# EAGLE design peltier (EAGLE 7.5.0)
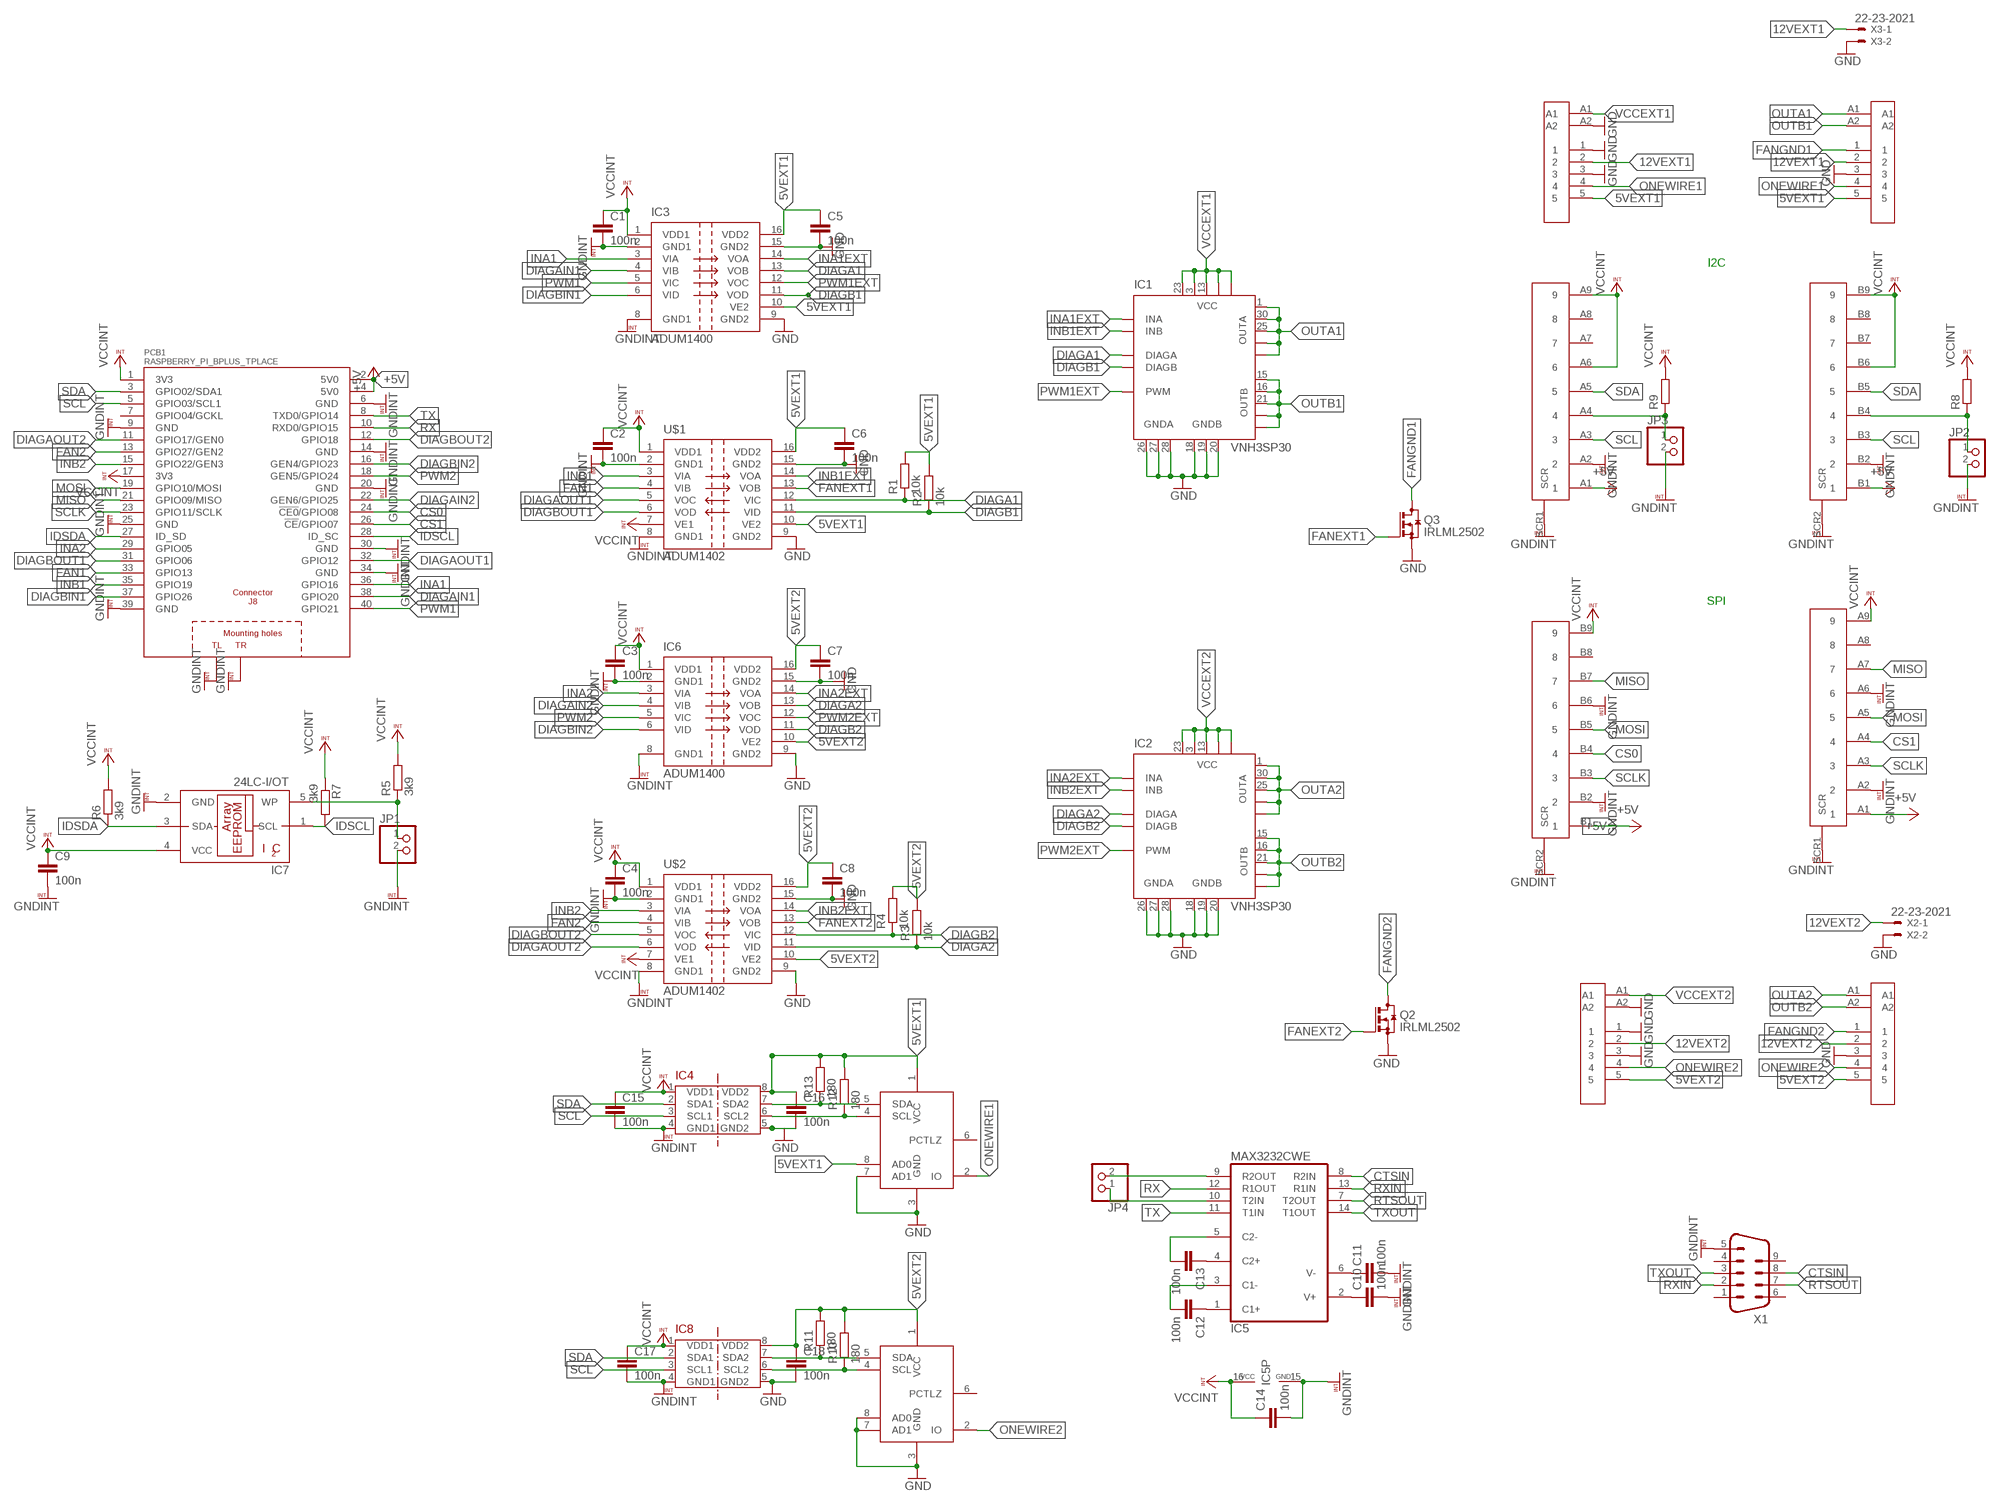
[diagram p0: schematic, sheet 1]

## Parts
C1  100n  C-EUC0805  [C0805]
C2  100n  C-EUC0805  [C0805]
C3  100n  C-EUC0805  [C0805]
C4  100n  C-EUC0805  [C0805]
C5  100n  C-EUC0805  [C0805]
C6  100n  C-EUC0805  [C0805]
C7  100n  C-EUC0805  [C0805]
C8  100n  C-EUC0805  [C0805]
C9  100n  C-EUC0805  [C0805]
C10  100n  C-EUC0805  [C0805]
C11  100n  C-EUC0805  [C0805]
C12  100n  C-EUC0805  [C0805]
C13  100n  C-EUC0805  [C0805]
C14  100n  C-EUC0805  [C0805]
C15  100n  C-EUC0805  [C0805]
C16  100n  C-EUC0805  [C0805]
C17  100n  C-EUC0805  [C0805]
C18  100n  C-EUC0805  [C0805]
IC1  VNH3SP30  [MULTIPOWERSO-30]
IC2  VNH3SP30  [MULTIPOWERSO-30]
IC3  ADUM1400  [SO16W]
IC4  ADUM1250  [SO08]
IC5  MAX3232CWE  [SO16L]
IC6  ADUM1400  [SO16W]
IC7  24LC-I/OT  [SOT23-5]
IC8  ADUM1250  [SO08]
JP1  PINHD-1X2  [1X02]
JP2  PINHD-1X2  [1X02]
JP3  PINHD-1X2  [1X02]
JP4  PINHD-1X2  [1X02]
PCB1  RASPBERRY_PI_BPLUS_TPLACE  [RASPBERRY_PI_BPLUS_TPLACE]
Q2  IRLML2502  BSS123  [SOT23]
Q3  IRLML2502  BSS123  [SOT23]
R1  10k  R-EU_R0805  [R0805]
R2  10k  R-EU_R0805  [R0805]
R3  10k  R-EU_R0805  [R0805]
R4  10k  R-EU_R0805  [R0805]
R5  3k9  R-EU_R0805  [R0805]
R6  3k9  R-EU_R0805  [R0805]
R7  3k9  R-EU_R0805  [R0805]
R8  R-EU_R0805  [R0805]
R9  R-EU_R0805  [R0805]
R10  180  R-EU_R0805  [R0805]
R11  180  R-EU_R0805  [R0805]
R12  180  R-EU_R0805  [R0805]
R13  180  R-EU_R0805  [R0805]
U$1  ADUM1402  [SO16W]
U$2  ADUM1402  [SO16W]
U$3  7W2-F  [7W2-F]
U$4  7W2-F  [7W2-F]
U$5  7W2-M  [7W2-M]
U$6  7W2-M  [7W2-M]
U$11  164A19919X  [164A19919X]
U$12  164A19919X  [164A19919X]
U$14  DS2483-100  [SO-08]
U$15  DS2483-100  [SO-08]
X1  M09HP  [M09HP]
X2  22-23-2021  [22-23-2021]
X3  22-23-2021  [22-23-2021]

## Nets
5VEXT1: C5.1 C6.1 C16.1 IC3.10(VE2) IC3.16(VDD2) IC4.8(VDD2) R1.2 R2.2 R12.2 R13.2 U$1.10(VE2) U$1.16(VDD2) U$3.5 U$5.5 U$14.1(VCC) U$14.8(AD0)
5VEXT2: C7.1 C8.1 C18.1 IC6.10(VE2) IC6.16(VDD2) IC8.8(VDD2) R3.2 R4.2 R10.2 R11.2 U$2.10(VE2) U$2.16(VDD2) U$4.5 U$6.5 U$15.1(VCC)
12VEXT1: U$3.2 U$5.2 X3.1
12VEXT2: U$4.2 U$6.2 X2.1
+5V: PCB1.2(5V0) PCB1.4(5V0) U$11.A1 U$11.B1 U$12.A1 U$12.B1
CS0: PCB1.24(!CE0!/GPIO08) U$12.B4
CS1: PCB1.26(!CE!/GPIO07) U$12.A4
CTSIN: IC5.8(R2IN) X1.8
DIAGA1: IC1.6(DIAGA) IC3.13(VOB) R1.1 U$1.12(VIC)
DIAGA2: IC2.6(DIAGA) IC6.13(VOB) R3.1 U$2.11(VID)
DIAGAIN1: IC3.4(VIB) PCB1.38(GPIO20)
DIAGAIN2: IC6.4(VIB) PCB1.22(GEN6/GPIO25)
DIAGAOUT1: PCB1.32(GPIO12) U$1.5(VOC)
DIAGAOUT2: PCB1.11(GPIO17/GEN0) U$2.6(VOD)
DIAGB1: IC1.10(DIAGB) IC3.11(VOD) R2.1 U$1.11(VID)
DIAGB2: IC2.10(DIAGB) IC6.11(VOD) R4.1 U$2.12(VIC)
DIAGBIN1: IC3.6(VID) PCB1.37(GPIO26)
DIAGBIN2: IC6.6(VID) PCB1.16(GEN4/GPIO23)
DIAGBOUT1: PCB1.31(GPIO06) U$1.6(VOD)
DIAGBOUT2: PCB1.12(GPIO18) U$2.5(VOC)
FAN1: PCB1.33(GPIO13) U$1.4(VIB)
FAN2: PCB1.13(GPIO27/GEN2) U$2.4(VIB)
FANEXT1: Q3.1(G) U$1.13(VOB)
FANEXT2: Q2.1(G) U$2.13(VOB)
FANGND1: Q3.3(D) U$3.1
FANGND2: Q2.3(D) U$4.1
GND: C5.2 C6.2 C7.2 C8.2 C16.2 C18.2 IC1.18(GNDB) IC1.19(GNDB) IC1.20(GNDB) IC1.26(GNDA) IC1.27(GNDA) IC1.28(GNDA) IC2.18(GNDB) IC2.19(GNDB) IC2.20(GNDB) IC2.26(GNDA) IC2.27(GNDA) IC2.28(GNDA) IC3.9(GND2) IC3.15(GND2) IC4.5(GND2) IC6.9(GND2) IC6.15(GND2) IC8.5(GND2) Q2.2(S) Q3.2(S) U$1.9(GND2) U$1.15(GND2) U$2.9(GND2) U$2.15(GND2) U$3.3 U$4.3 U$5.1 U$5.3 U$5.A2 U$6.1 U$6.3 U$6.A2 U$14.3(GND) U$14.7(AD1) U$15.3(GND) U$15.7(AD1) U$15.8(AD0) X2.2 X3.2
GNDINT: C1.2 C2.2 C3.2 C4.2 C9.2 C10.2 C11.2 C14.2 C15.2 C17.2 IC3.2(GND1) IC3.8(GND1) IC4.4(GND1) IC5.15(GND) IC6.2(GND1) IC6.8(GND1) IC7.2(GND) IC8.4(GND1) JP1.2 JP2.2 JP3.2 PCB1.6(GND) PCB1.9(GND) PCB1.14(GND) PCB1.20(GND) PCB1.25(GND) PCB1.30(GND) PCB1.34(GND) PCB1.39(GND) PCB1.PE_TL(TL) PCB1.PE_TR(TR) U$1.2(GND1) U$1.8(GND1) U$2.2(GND1) U$2.8(GND1) U$11.A2 U$11.B2 U$11.SCR1(A:SCR) U$11.SCR2(B:SCR) U$12.A2 U$12.A6 U$12.B2 U$12.B6 U$12.SCR1(A:SCR) U$12.SCR2(B:SCR) X1.5
IDSCL: IC7.1(SCL) PCB1.28(ID_SC) R7.2
IDSDA: IC7.3(SDA) PCB1.27(ID_SD) R6.1
INA1: IC3.3(VIA) PCB1.36(GPIO16)
INA1EXT: IC1.5(INA) IC3.14(VOA)
INA2: IC6.3(VIA) PCB1.29(GPIO05)
INA2EXT: IC2.5(INA) IC6.14(VOA)
INB1: PCB1.35(GPIO19) U$1.3(VIA)
INB1EXT: IC1.11(INB) U$1.14(VOA)
INB2: PCB1.15(GPIO22/GEN3) U$2.3(VIA)
INB2EXT: IC2.11(INB) U$2.14(VOA)
MISO: PCB1.21(GPIO09/MISO) U$12.A7 U$12.B7
MOSI: PCB1.19(GPIO10/MOSI) U$12.A5 U$12.B5
N$28: IC7.5(WP) JP1.1 R5.1
N$38: JP3.1 R9.1 U$11.A4
N$39: JP2.1 R8.1 U$11.B4
N$59: C10.1 IC5.2(V+)
N$60: C11.1 IC5.6(V-)
N$61: C12.1 IC5.1(C1+)
N$62: C12.2 IC5.3(C1-)
N$63: C13.1 IC5.4(C2+)
N$64: C13.2 IC5.5(C2-)
N$68: IC5.9(R2OUT) JP4.2
N$69: IC5.10(T2IN) JP4.1
N$71: IC4.7(SDA2) R13.1 U$14.5(SDA)
N$72: IC4.6(SCL2) R12.1 U$14.4(SCL)
N$74: IC8.7(SDA2) R11.1 U$15.5(SDA)
N$75: IC8.6(SCL2) R10.1 U$15.4(SCL)
ONEWIRE1: U$3.4 U$5.4 U$14.2(IO)
ONEWIRE2: U$4.4 U$6.4 U$15.2(IO)
OUTA1: IC1.1(OUTA) IC1.25(OUTA) IC1.30(OUTA) IC1.OUTA IC1.OUTA@1(OUTA) U$3.A1
OUTA2: IC2.1(OUTA) IC2.25(OUTA) IC2.30(OUTA) IC2.OUTA IC2.OUTA@1(OUTA) U$4.A1
OUTB1: IC1.15(OUTB) IC1.16(OUTB) IC1.21(OUTB) IC1.OUTB IC1.OUTB@1(OUTB) U$3.A2
OUTB2: IC2.15(OUTB) IC2.16(OUTB) IC2.21(OUTB) IC2.OUTB IC2.OUTB@1(OUTB) U$4.A2
PWM1: IC3.5(VIC) PCB1.40(GPIO21)
PWM1EXT: IC1.8(PWM) IC3.12(VOC)
PWM2: IC6.5(VIC) PCB1.18(GEN5/GPIO24)
PWM2EXT: IC2.8(PWM) IC6.12(VOC)
RTSOUT: IC5.7(T2OUT) X1.7
RX: IC5.12(R1OUT) PCB1.10(RXD0/GPIO15)
RXIN: IC5.13(R1IN) X1.2
SCL: IC4.3(SCL1) IC8.3(SCL1) PCB1.5(GPIO03/SCL1) U$11.A3 U$11.B3
SCLK: PCB1.23(GPIO11/SCLK) U$12.A3 U$12.B3
SDA: IC4.2(SDA1) IC8.2(SDA1) PCB1.3(GPIO02/SDA1) U$11.A5 U$11.B5
TX: IC5.11(T1IN) PCB1.8(TXD0/GPIO14)
TXOUT: IC5.14(T1OUT) X1.3
VCCEXT1: IC1.3(VCC) IC1.13(VCC) IC1.23(VCC) IC1.VCC IC1.VCC@1(VCC) U$5.A1
VCCEXT2: IC2.3(VCC) IC2.13(VCC) IC2.23(VCC) IC2.VCC IC2.VCC@1(VCC) U$6.A1
VCCINT: C1.1 C2.1 C3.1 C4.1 C9.1 C14.1 C15.1 C17.1 IC3.1(VDD1) IC4.1(VDD1) IC5.16(VCC) IC6.1(VDD1) IC7.4(VCC) IC8.1(VDD1) PCB1.1(3V3) PCB1.17(3V3) R5.2 R6.2 R7.1 R8.2 R9.2 U$1.1(VDD1) U$1.7(VE1) U$2.1(VDD1) U$2.7(VE1) U$11.A6 U$11.A9 U$11.B6 U$11.B9 U$12.A9 U$12.B9
Unconnected: PCB1.7(GPIO04/GCKL) U$11.A7 U$11.A8 U$11.B7 U$11.B8 U$12.A8 U$12.B8 U$14.6(PCTLZ) U$15.6(PCTLZ) X1.1 X1.4 X1.6 X1.9

## Notes on the sheet
- I2C
- SPI

## Library data of the parts
C1-C18 = rcl:C-EU: CAPACITOR, European symbol
IC1 IC2 = custom:VNH3SP30: FULLY INTEGRATED H-BRIDGE MOTOR DRIVER Source: http://pdf1.alldatasheet.com/datasheet-pdf/view/84563/STMICROELECTRONICS/VNH3SP30.html; MPN: VNH3SP30-E; OC_FARNELL: 1739420; OC_NEWARK: 33R1486
IC3 IC6 = adum140x:ADUM1400
IC4 IC8 = Bus-isolators:ADUM1250
IC5 = maxim:MAX3232*: True RS-232 Transceivers 3.0V to 5.5V, Low-Power up to 1Mbps, Using Four 0.1µF External Capacitors Source: http://pdfserv.maxim-ic.com/en/ds/MAX3222-MAX3241.pdf; MF: MAXIM; MPN: MAX3232CWE+; OC_FARNELL: 9725504; OC_NEWARK: 68K4630
IC7 = we-chip:24LC*: Microchip I2C EEPROM 2 Kbit - 24LC02B - 24LC02BT-I/OTDKR-ND 32 Kbit- 24LC32A - 24LC32AT-I/OTDKR-ND; DIGIKEY: 24LC32AT-I/OTDKR-ND
JP1-JP4 = pinhead:PINHD-1X2: PIN HEADER
PCB1 = custom:RASPBERRY_PI_BPLUS: Raspberry Pi B+ Basedon issue: Thursday, July 10, 2014 - Rev 1.2 LBR by Tim Rettmann 07-2014
Q2 Q3 = transistor-small-signal:BSS123: N-CHANNEL MOS FET
R1-R13 = rcl:R-EU_: RESISTOR, European symbol
U$1 U$2 = adum140x:ADUM1402
U$3 U$4 = conec:7W2-F
U$5 U$6 = conec:7W2-M
U$11 U$12 = conec:164A19919X
U$14 U$15 = custom:DS2483-100
X1 = con-subd:M09: SUB-D; OC_FARNELL: unknown; OC_NEWARK: unknown
X2 X3 = con-molex:22-23-2021: .100" (2.54mm) Center Header - 2 Pin; MF: MOLEX; MPN: 22-23-2021; OC_FARNELL: 1462926; OC_NEWARK: 25C3832

## Board
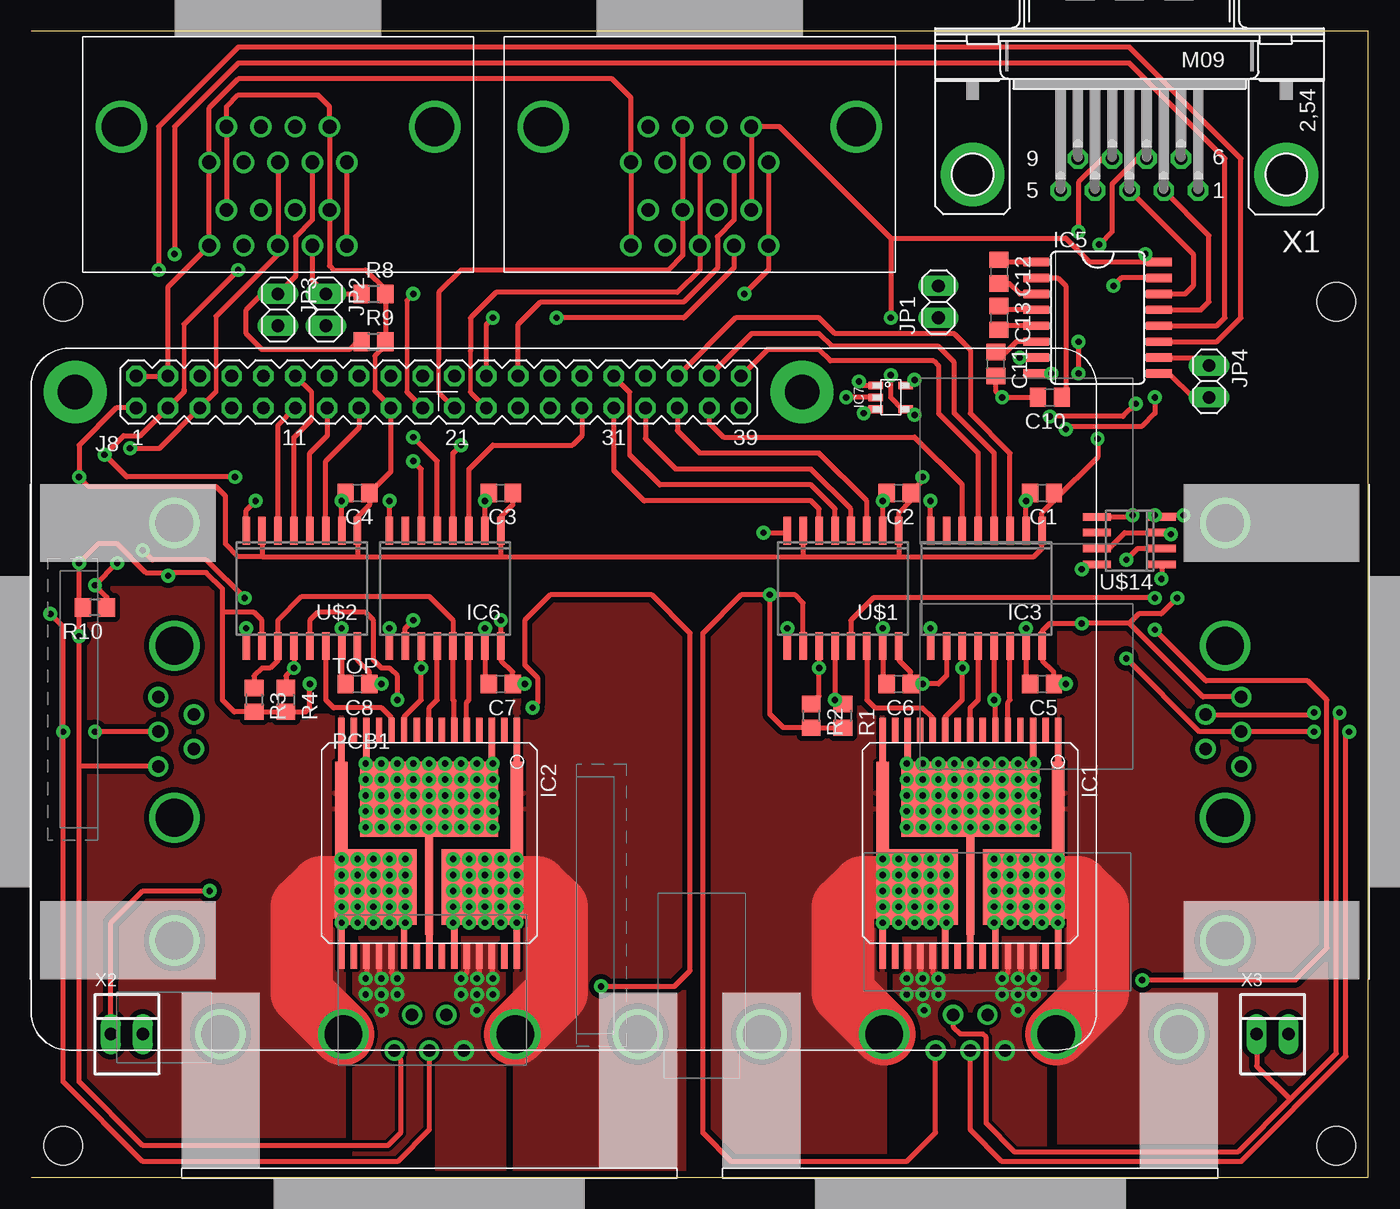
[diagram p1: board, top side]
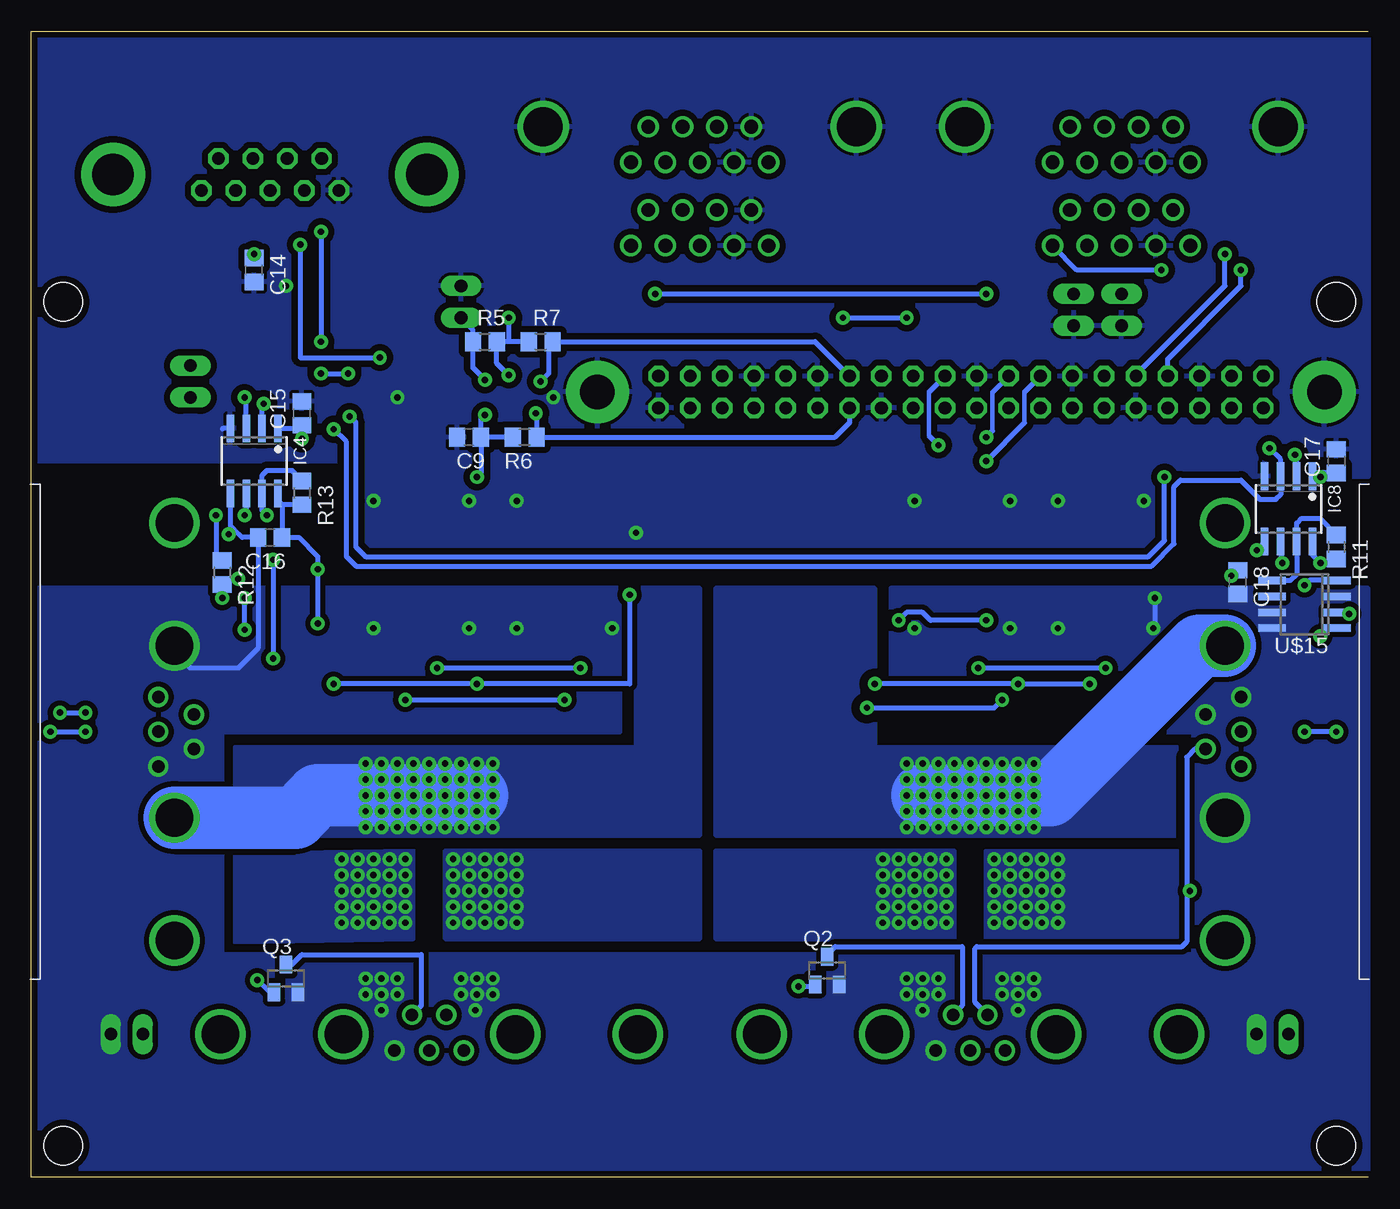
[diagram p2: board, bottom side, seen from below]

Size 106.68 x 91.43 mm. Coordinates in mm from the lower left corner, seen from the top.
Outline: 0,0 106.68,0 106.68,91.43 0,91.43
Copper layers (1*16): Top 0.035mm / dielectric 1.5mm / Bottom 0.035mm
Design rules "Standard10_lpt": minimum track width 10mil, minimum drill 16mil, track to track 10mil, track to pad 10mil, pad to pad 10mil, via to via 10mil, smd to smd 0mil, copper to edge 20mil, drill to drill 8mil, minimum pad ring 12mil, minimum via ring 12mil, stop-mask expansion 4mil, vias tented up to drill 0mil, thermal gap 10mil
Holes 3.1 mm at 2.54,2.54 104.14,2.54 2.54,69.85 104.14,69.85

### Footprints (pad centres in the part's own frame; a part is rotated, then mirrored left to right if it is on the bottom)
C0805 = smd 1.3 x 1.5: 1 -0.95,0; 2 0.95,0
MULTIPOWERSO-30 = smd 0.508 x 12: 1 -7,-4; 15 7,-4; 16 7,4; 30 -7,4 | smd 0.508 x 2: 2 -6,-9; 4 -4,-9; 5 -3,-9; 6 -2,-9; 7 -1,-9; 8 0,-9; 9 1,-9; 10 2,-9; 11 3,-9; 12 4,-9; 14 6,-9; 17 6,9; 18 5,9; 19 4,9; 20 3,9; 22 1,9; 24 -1,9; 26 -3,9; 27 -4,9; 28 -5,9; 29 -6,9 | smd 0.508 x 4: 3 -5,-8; 13 5,-8; 21 2,8; 23 0,8; 25 -2,8 | smd 6.5 x 6: OUTA -4.25,3.5; OUTB 4.25,3.5 | smd 1 x 7.5: OUTA@1 -7,-2.755; OUTB@1 7,-2.755 | smd 11 x 6: VCC 0,-3.5 | smd 0.65 x 8.3: VCC@1 0,3.145
SO16W = smd 0.6 x 2.2: 1 -4.445,-4.6; 2 -3.175,-4.6; 3 -1.905,-4.6; 4 -0.635,-4.6; 5 0.635,-4.6; 6 1.905,-4.6; 7 3.175,-4.6; 8 4.445,-4.6; 9 4.445,4.6; 10 3.175,4.6; 11 1.905,4.6; 12 0.635,4.6; 13 -0.635,4.6; 14 -1.905,4.6; 15 -3.175,4.6; 16 -4.445,4.6
SO08 = smd 0.6 x 2.2: 1 -1.905,-2.6; 2 -0.635,-2.6; 3 0.635,-2.6; 4 1.905,-2.6; 5 1.905,2.6; 6 0.635,2.6; 7 -0.635,2.6; 8 -1.905,2.6
SO16L = smd 0.66 x 2.032: 1 -4.445,-4.902; 2 -3.175,-4.902; 3 -1.905,-4.902; 4 -0.635,-4.902; 5 0.635,-4.902; 6 1.905,-4.902; 7 3.175,-4.902; 8 4.445,-4.902; 9 4.445,4.902; 10 3.175,4.902; 11 1.905,4.902; 12 0.635,4.902; 13 -0.635,4.902; 14 -1.905,4.902; 15 -3.175,4.902; 16 -4.445,4.902
SOT23-5 = smd 1.2 x 0.6: 1 -1.2,0.95; 2 -1.2,0; 3 -1.2,-0.95; 4 1.2,-0.95; 5 1.2,0.95
1X02 = drill 1.016 long: 1 -1.27,0; 2 1.27,0
RASPBERRY_PI_BPLUS_TPLACE = drill 1.016 octagon: 1 8.37,51.23; 2 8.37,53.77; 3 10.91,51.23; 4 10.91,53.77; 5 13.45,51.23; 6 13.45,53.77; 7 15.99,51.23; 8 15.99,53.77; 9 18.53,51.23; 10 18.53,53.77; 11 21.07,51.23; 12 21.07,53.77; 13 23.61,51.23; 14 23.61,53.77; 15 26.15,51.23; 16 26.15,53.77; 17 28.69,51.23; 18 28.69,53.77; 19 31.23,51.23; 20 31.23,53.77; 21 33.77,51.23; 22 33.77,53.77; 23 36.31,51.23; 24 36.31,53.77; 25 38.85,51.23; 26 38.85,53.77; 27 41.39,51.23; 28 41.39,53.77; 29 43.93,51.23; 30 43.93,53.77; 31 46.47,51.23; 32 46.47,53.77; 33 49.01,51.23; 34 49.01,53.77; 35 51.55,51.23; 36 51.55,53.77; 37 54.09,51.23; 38 54.09,53.77; 39 56.63,51.23; 40 56.63,53.77 | drill 2.75 pad 5: PE_TL 3.5,52.5; PE_TR 61.5,52.5
SOT23 = smd 1 x 1.4: 1 -0.95,-1.1; 2 0.95,-1.1; 3 0,1.1
R0805 = smd 1.3 x 1.5: 1 -0.95,0; 2 0.95,0
7W2-F = drill 1: 1 1.37,1.54; 2 -1.37,1.54; 3 2.77,-1.3; 4 0,-1.3; 5 -2.77,-1.3 | drill 3: A1 6.86,0; A2 -6.86,0; P$1 -16.65,0; P$2 16.65,0
7W2-M = drill 1: 1 -1.37,1.54; 2 1.37,1.54; 3 -2.77,-1.3; 4 0,-1.3; 5 2.77,-1.3 | drill 3: A1 -6.86,0; A2 6.86,0; A3 -16.65,0; A4 16.65,0
164A19919X = drill 1.1: A1 5.49,2.84; A2 2.74,2.84; A3 0,2.84; A4 -2.74,2.84; A5 -5.49,2.84; A6 4.11,0; A7 1.37,0; A8 -1.37,0; A9 -4.11,0; B1 5.49,9.49; B2 2.74,9.49; B3 0,9.49; B4 -2.74,9.49; B5 -5.49,9.49; B6 4.11,6.65; B7 1.37,6.65; B8 -1.37,6.65; B9 -4.11,6.65 | drill 3.1: SCR1 -12.5,0; SCR2 12.5,0
SO-08 = smd 0.6 x 2.2: 1 -1.905,-2.6; 2 -0.635,-2.6; 3 0.635,-2.6; 4 1.905,-2.6; 5 1.905,2.6; 6 0.635,2.6; 7 -0.635,2.6; 8 -1.905,2.6
M09HP = drill 1.016 octagon: 1 -5.486,1.27; 2 -2.743,1.27; 3 0,1.27; 4 2.743,1.27; 5 5.486,1.27; 6 -4.115,-1.27; 7 -1.372,-1.27; 8 1.372,-1.27; 9 4.115,-1.27 | drill 3.302 pad 5.08: G1 -12.522,0; G2 12.522,0
22-23-2021 = drill 1 long: 1 -1.27,0; 2 1.27,0

### Placement (x,y rotation side)
C1  80.64,54.61 180 top
C2  69.22,54.61 180 top
C3  37.47,54.61 180 top
C4  26.04,54.61 180 top
C5  80.64,39.37 180 top
C6  69.22,39.37 180 top
C7  37.47,39.37 180 top
C8  26.04,39.37 180 top
C9  71.75,59.05 180 bottom
C10  81.28,62.23 180 top
C11  76.96,64.9 270 top
C12  77.22,72.26 270 top
C13  77.22,68.58 270 top
C14  88.9,72.39 270 bottom
C15  85.09,60.96 90 bottom
C16  87.63,51.05 180 bottom
C17  2.54,57.15 90 bottom
C18  10.41,47.5 270 bottom
IC1  74.93,26.67 180 top
IC2  31.75,26.67 180 top
IC3  76.2,46.99 180 top
IC4  88.9,57.15 180 bottom
IC5  85.09,68.58 270 top
IC6  33.02,46.99 180 top
IC7  68.58,62.23 0 top
IC8  6.35,53.34 180 bottom
JP1  72.39,69.85 90 top
JP2  23.5,69.22 270 top
JP3  19.68,69.22 270 top
JP4  93.98,63.5 270 top
PCB1  0,10.16 0 top
Q2  43.18,16.51 0 bottom
Q3  86.36,15.88 0 bottom
R1  64.77,36.83 270 top
R2  62.23,36.83 270 top
R3  17.78,38.1 270 top
R4  20.32,38.1 270 top
R5  70.48,66.67 0 bottom
R6  67.31,59.05 180 bottom
R7  66.04,66.67 0 bottom
R8  27.3,70.48 0 top
R9  27.3,66.67 0 top
R10  5.08,45.47 180 top
R11  2.54,50.29 270 bottom
R12  91.44,48.26 270 bottom
R13  85.09,54.61 270 bottom
U$1  64.77,46.99 180 top
U$2  21.59,46.99 180 top
U$3  74.93,11.43 0 top
U$4  31.75,11.43 0 top
U$5  95.25,35.56 90 top
U$6  11.43,35.56 270 top
U$11  19.68,83.82 180 top
U$12  53.34,83.82 180 top
U$14  87.63,50.8 90 top
U$15  5.08,45.72 90 bottom
X1  87.63,80.01 180 top
X2  7.62,11.43 0 top
X3  99.06,11.43 0 top

### Tracks (layer width: path | path; a pad name or v marks a point on that pad's centre or on a via)
5VEXT1  (via drill 0.5)
  Top 0.406: U$1.16 69.22,41.27 70.17,40.32 C6.1 v71.12,39.37 72.39,39.37 73.03,40 IC3.10 | v82.55,39.37 C5.1 81.59,40.32 80.64,41.27 IC3.16 80.64,43.56 81.28,44.2 v83.82,44.2 87.63,44.2 | v58.93,46.48 58.93,36.96 60.01,35.88 R2.2 R1.2 | U$1.10 61.59,45.85 60.96,46.48 v58.93,46.48 | U$3.5 72.16,3.58 69.85,1.27 55.88,1.27 53.59,3.56 53.59,43.43 56.64,46.48 v58.93,46.48 | U$14.1 90.23,47.81 v90.17,47.75 | U$14.8 84.2,48.89 v83.82,48.51 | 87.63,44.2 93.5,38.33 U$5.5 | v91.44,46.23 90.17,44.96 88.39,44.96 87.63,44.2
  Bottom 0.406: v58.93,46.48 58.93,39.37 v71.12,39.37 v82.55,39.37 | R13.2 86.68,53.66 | 86.68,53.66 87,53.97 IC4.8 | R12.2 91.44,46.99 | 91.24,47.11 R12.2 | v83.82,44.2 v83.82,48.51 83.82,49.53 85.34,51.05 C16.1 86.68,53.66 | v90.17,47.75 91,47.75 R12.2 | R12.2 v91.44,46.23
5VEXT2  (via drill 0.5)
  Top 0.406: U$2.16 26.04,41.27 26.98,40.32 C8.1 v27.94,39.37 | v39.37,39.37 C7.1 38.41,40.32 37.47,41.27 IC6.16 v37.47,44.45 | v22.23,39.37 22.23,37.46 21.91,37.15 R4.2 R3.2 16.19,37.15 15.24,38.1 15.24,45.09 | U$2.10 18.41,44.45 17.78,45.09 15.24,45.09 | IC6.10 29.84,43.81 v30.48,44.45 | 15.24,45.09 15.24,46.99 13.97,48.26 10.67,48.26 | 3.81,32.79 3.81,7.62 8.89,2.54 28.45,2.54 29.46,3.56 29.46,9.4 28.98,9.88 U$4.5 | 3.81,45.72 v3.81,43.18 3.81,33.02 3.81,32.79 | 3.81,45.72 v3.81,49.02 5.33,50.55 6.86,50.55 9.14,48.26 10.67,48.26 | R10.2 4.06,45.47 3.81,45.72 | 10.67,48.26 v10.92,48.01 | U$6.5 3.81,32.79
  Bottom 0.406: v39.37,39.37 v27.94,39.37 v22.23,39.37 | v30.48,44.45 34.92,44.45 35.56,45.09 36.83,45.09 v37.47,44.45 | 2.61,49.28 R11.2 2.86,49.02 v3.81,49.02 4.45,49.66 IC8.8 | U$15.1 3.17,43.81 v3.81,43.18 | v10.92,48.01 10.86,48.01 C18.1
12VEXT1  (via drill 0.5)
  Top 0.406: v104.39,37.08 104.14,36.83 104.14,9.91 100.46,6.22 | 100.46,6.22 96.27,2.03 78.49,2.03 76.2,4.32 76.2,11.18 75.95,11.43 74.17,11.43 73.56,12.04 U$3.2 | X3.1 97.79,8.89 100.46,6.22 | U$5.2 102.21,36.93 v102.36,37.08
  Bottom 0.406: v104.39,37.08 v102.36,37.08
12VEXT2  (via drill 0.5)
  Top 0.406: X2.1 6.35,20.32 8.89,22.86 v14.22,22.86
  Bottom 0.406: U$4.2 31.38,13.97 31.38,18.28 31.24,18.41 14.86,18.41 14.48,18.8 14.48,22.61 v14.22,22.86 14.48,23.11 14.48,33.53 13.82,34.19 U$6.2
+5V
  Top 0.406: PCB1.2 PCB1.4 10.91,71.05 U$11.B1 U$11.A1 14.2,85.31 16.51,87.63 46.35,87.63 47.85,86.14 U$12.A1 U$12.B1
CS0  (via drill 0.5)
  Top 0.406: U$12.B4 56.08,72.59 52.07,68.58 v41.91,68.58 | PCB1.24 36.31,68.06 v36.83,68.58
  Bottom 0.406: v41.91,68.58 v36.83,68.58
CS1
  Top 0.406: U$12.A4 56.08,76.4 54.74,75.06 54.74,72.52 52.07,69.85 40.64,69.85 38.85,68.06 PCB1.26
CTSIN  (via drill 0.5)
  Top 0.406: X1.8 85.47,81.28 83.57,79.38 v83.57,75.44 | v83.57,66.67 v83.57,64.14 | v81.41,64.14 IC5.8
  Bottom 0.406: v83.57,75.44 v83.57,66.67 | v83.57,64.14 v81.41,64.14
DIAGA1  (via drill 0.5)
  Top 0.406: IC1.6 76.93,38.01 v76.83,38.1 IC3.13 | U$1.12 64.14,38.41 | 64.14,38.41 R1.1 | v64.14,38.1 64.14,38.41
  Bottom 0.406: v76.83,38.1 v64.14,38.1
DIAGA2
  Top 0.406: IC2.6 33.75,38.01 33.66,38.1 IC6.13 33.66,44.45 31.75,46.35 21.59,46.35 19.68,44.45 U$2.11 19.68,41.27 19.05,40.64 18.41,40.64 17.78,40 R3.1 17.78,39.37
DIAGAIN1
  Top 0.406: IC3.4 76.83,57.78 73.66,60.96 73.66,65.02 72.39,66.29 63.88,66.29 62.87,67.31 57.47,67.31 PCB1.38
DIAGAIN2  (via drill 0.5)
  Top 0.406: IC6.4 33.66,57.78 v34.29,58.42
  Bottom 0.356: 35.05,59.18 35.05,62.65
  Bottom 0.406: v34.29,58.42 35.05,59.18 | 35.05,62.65 PCB1.22
DIAGAOUT1
  Top 0.356: 47.75,57.66 47.75,62.65
  Top 0.406: U$1.5 64.14,53.34 62.23,55.24 50.16,55.24 47.75,57.66 | 47.75,62.65 PCB1.32
DIAGAOUT2
  Top 0.406: U$2.6 19.68,60 PCB1.11
DIAGB1  (via drill 0.5)
  Top 0.406: IC1.10 72.93,36.73 74.3,38.1 v74.3,40.64 IC3.11 | U$1.11 v62.87,40.64 62.87,38.41 R2.1
  Bottom 0.406: v62.87,40.64 v74.3,40.64
DIAGB2  (via drill 0.5)
  Top 0.406: IC2.10 29.75,36.73 31.11,38.1 v31.11,40.64 IC6.11 | U$2.12 v20.95,40.64 20.32,40 R4.1
  Bottom 0.406: v20.95,40.64 v31.11,40.64
DIAGBIN1
  Top 0.406: PCB1.37 54.09,60.21 55.24,59.05 70.48,59.05 74.3,55.24 IC3.6
DIAGBIN2  (via drill 0.5)
  Top 0.406: IC6.6 31.11,56.52 v30.48,57.15
  Bottom 0.356: 27.43,60.2 27.43,62.65
  Bottom 0.406: v30.48,57.15 27.43,60.2 | 27.43,62.65 PCB1.16
DIAGBOUT1
  Top 0.406: U$1.6 62.87,53.34 62.23,53.97 48.9,53.97 46.47,56.4 PCB1.31
DIAGBOUT2
  Top 0.356: 22.35,60.45 22.35,62.65
  Top 0.406: U$2.5 20.95,59.05 22.35,60.45 | 22.35,62.65 PCB1.12
FAN1
  Top 0.406: U$1.4 65.41,53.34 62.23,56.52 51.44,56.52 49.01,58.94 PCB1.33
FAN2
  Top 0.406: U$2.4 22.23,57.78 23.61,59.17 PCB1.13
FANEXT1  (via drill 0.5)
  Top 0.406: U$1.13 65.41,44.45 67.18,46.23 v89.66,46.23 | v88.65,15.75 100.84,15.75 103.38,18.29 103.38,38.1 101.85,39.62 93.73,39.62 v89.66,43.69
  Bottom 0.406: Q3.1 87.31,14.92 87.82,14.92 v88.65,15.75 | v89.66,43.69 v89.66,46.23
FANEXT2  (via drill 0.5)
  Top 0.406: 22.23,41.91 U$2.13 22.23,44.45 22.86,45.09 26.67,45.09 27.3,44.45 27.3,41.27 27.94,40.64 28.57,40.64 29.21,40 v29.21,38.1 | v45.47,15.24 51.31,15.24 52.58,16.51 52.58,43.43 49.53,46.48 41.4,46.48 39.37,44.45 39.37,40.89 40.39,39.88 40.39,37.85 v40.01,37.46
  Bottom 0.406: v40.01,37.46 29.84,37.46 v29.21,38.1 | v45.47,15.24 44.3,15.24 Q2.1
FANGND1
  Bottom 0.406: Q3.3 85.89,16.98 85.09,17.78 75.56,17.78 75.56,13.71 U$3.1
FANGND2
  Bottom 0.406: Q2.3 43.18,17.78 42.55,18.41 32.38,18.41 32.38,13.71 U$4.1
GND  (via drill 0.5)
  Top 0.406: IC1.18 69.93,15.96 v69.85,15.88 | IC1.19 70.93,16.07 v71.12,15.88 | IC1.20 71.93,16.34 v72.39,15.88 | IC1.26 77.93,16.34 v77.47,15.88 | IC1.27 78.93,16.07 v78.74,15.88 | IC1.28 79.93,15.96 v80.01,15.88 | IC2.26 34.75,16.34 v34.29,15.88 | IC2.27 35.75,16.07 v35.56,15.88 | IC2.28 36.75,15.96 v36.83,15.88 | IC2.19 27.75,16.07 v27.94,15.88 | IC2.18 26.75,15.96 v26.67,15.88 | U$2.9 v17.14,43.81 | IC6.9 v28.57,43.81 | U$1.9 v60.33,43.81 | IC3.9 v71.75,43.81 | C8.2 24.77,39.69 U$2.15 v24.77,43.81 | C7.2 36.2,39.69 IC6.15 v36.2,43.81 | C6.2 67.94,39.69 U$1.15 v67.94,43.81 | C5.2 79.38,39.69 IC3.15 v79.38,43.81 | IC2.20 28.75,16.34 v29.21,15.88 | v17.02,46.23 13.97,49.28 9.65,49.28 v8.89,50.04 | v90.93,51.31 90.81,51.43 U$14.3 87.25,51.43 85.98,50.16 U$14.7
  Bottom 0.406: 8.31,50.8 IC8.5 8.26,50.67 v8.89,50.04 | v17.02,46.23 17.02,43.94 v17.14,43.81 | IC4.5 90.81,52.01 90.52,51.72 | 90.52,51.72 89.85,51.05 C16.2 88.58,42.23 90.17,40.64 93.98,40.64 95.25,41.91 U$5.A2 | v90.93,51.31 90.52,51.72
  other vias: 27.94,14.61 26.67,14.61 29.21,14.61 27.94,13.34 34.29,14.61 35.56,14.61 36.83,14.61 35.56,13.34 71.12,14.61 69.85,14.61 72.39,14.61 71.25,13.34 77.47,14.61 78.74,14.61 80.01,14.61 78.74,13.34
  pour Bottom (isolate 0.406, no thermals): 0,0 0,46.99 38.1,46.99 38.1,35.56 13.97,35.56 13.97,17.78 91.44,17.78 91.44,35.56 59.69,35.56 59.69,46.99 106.68,46.99 106.68,0
  pour Top (no thermals): 25.78,0.13 32.13,0.13 32.38,19.05 25.78,19.05
  pour Top (no thermals): 32.38,19.05 32.38,0.63 37.72,0.63 37.72,13.97 37.59,19.05
  pour Top (isolate 0.406, no thermals): 68.96,19.05 75.56,19.05 75.56,0.63 68.96,0.63
  pour Top (no thermals): 75.56,19.05 75.56,0.63 80.9,0.63 80.9,15.24 81.03,15.24 81.03,19.05
GNDINT  (via drill 0.5)
  Top 0.406: IC6.8 v28.57,53.97 | IC6.2 v36.2,53.97 36.2,54.29 C3.2 | IC3.2 v79.38,53.97 79.38,54.29 C1.2 | IC3.8 v71.75,53.97 | U$1.2 v67.94,53.97 67.94,54.29 67.95,54.29 C2.2 | U$2.2 v24.77,53.97 24.77,54.29 C4.2 | IC5.15 87,71.76 v86.36,71.12 | v58.42,51.43 60.17,51.43 U$1.8 | C10.2 v77.47,62.23 76.96,62.74 C11.2 | IC7.2 v65.02,62.23 | U$2.8 17.14,53.21 v17.91,53.97
  Bottom 0.406: IC4.4 91.38,59.75 91.44,59.69
  pour Bottom (isolate 0.508): 0,91.44 0,55.88 15.49,55.88 15.49,48.26 81.28,48.26 81.28,57.15 106.68,57.15 106.68,91.44
IDSCL  (via drill 0.5)
  Top 0.406: v66.04,63.5 66.36,63.18 IC7.1
  Bottom 0.406: PCB1.28 44.13,66.67 R7.2 65.41,66.36 65.41,64.14 v66.04,63.5
IDSDA  (via drill 0.5)
  Top 0.406: IC7.3 66.74,61.28 v66.42,60.96
  Bottom 0.406: v66.42,60.96 66.36,60.9 R6.1 42.55,59.05 41.39,60.21 PCB1.27
INA1
  Top 0.406: IC3.3 78.11,57.78 74.93,60.96 74.93,66.04 73.66,67.31 64.14,67.31 62.87,68.58 56.2,68.58 PCB1.36
INA1EXT
  Top 0.406: IC1.5 77.93,37.92 78.11,38.1 IC3.14
INA2
  Top 0.406: IC6.3 34.92,56.52 36.83,58.42 43.18,58.42 43.93,59.17 PCB1.29
INA2EXT
  Top 0.406: IC2.5 34.75,37.92 34.92,38.1 IC6.14
INB1
  Top 0.406: U$1.3 66.67,53.97 62.87,57.78 53.34,57.78 51.55,59.57 PCB1.35
INB1EXT
  Top 0.406: U$1.14 66.67,38.1 67.31,37.46 71.12,37.46 71.93,36.66 IC1.11
INB2
  Top 0.406: U$2.3 23.5,57.15 26.15,59.8 PCB1.15
INB2EXT
  Top 0.406: U$2.14 23.5,38.1 24.13,37.46 27.94,37.46 28.75,36.66 IC2.11
MISO
  Top 0.356: 32.51,65.28 32.51,62.65
  Top 0.406: U$12.A7 U$12.B7 51.97,73.56 50.8,72.39 34.29,72.39 32.51,70.61 32.51,65.28 | 32.51,62.65 PCB1.21
MOSI  (via drill 0.5)
  Top 0.356: 29.97,69.98 29.97,62.65
  Top 0.406: U$12.A5 U$12.B5 58.83,72.42 v56.9,70.48 | v30.48,70.48 29.97,69.98 | 29.97,62.65 PCB1.19
  Bottom 0.406: v56.9,70.48 v30.48,70.48
N$28  (via drill 0.5)
  Top 0.356: IC7.5 70.04,63.18
  Top 0.406: 70.04,63.18 v70.48,63.63
  Bottom 0.406: v70.48,63.63 71.44,64.58 R5.1 71.44,67.62 JP1.1
N$38
  Top 0.406: U$11.A4 22.43,76.4 21.08,75.06 21.08,71.88 JP3.1 18.41,70.48 17.14,69.22 17.14,67.31 18.41,66.04 25.4,66.04 26.04,66.67 R9.1
N$39
  Top 0.406: U$11.B4 22.43,71.56 JP2.1 R8.1
N$59
  Top 0.406: IC5.2 81.92,71.76 82.55,71.12 82.55,62.55 C10.1
N$60
  Top 0.406: IC5.6 78.61,66.67 77.72,65.79 77.02,65.79 C11.1
N$61
  Top 0.406: IC5.1 77.4,73.03 C12.1
N$62
  Top 0.406: IC5.3 78.87,70.48 78.04,71.31 C12.2
N$63
  Top 0.406: IC5.4 77.53,69.22 C13.1
N$64
  Top 0.406: IC5.5 77.53,67.95 C13.2
N$68
  Top 0.406: IC5.9 90.81,64.14 92.71,62.23 JP4.2
N$69
  Top 0.406: IC5.10 93.34,65.41 JP4.1
N$71  (via drill 0.5)
  Top 0.406: U$14.5 87.76,52.7 v87.88,52.83
  Bottom 0.406: R13.1 85.09,55.63 85.85,56.39 87.88,56.39 88.27,56.01 IC4.7 88.27,53.21 v87.88,52.83
N$72  (via drill 0.5)
  Top 0.406: U$14.4 90.1,52.83 v89.66,52.83 v91.95,52.83
  Bottom 0.406: IC4.6 89.53,52.96 v89.66,52.83 | v91.95,52.83 91.95,49.72 R12.1
N$74
  Bottom 0.406: R11.1 3.88,52.58 5.33,52.58 5.71,52.2 IC8.7 5.71,48.13 6.22,47.62 U$15.5
N$75  (via drill 0.5)
  Top 0.406: v6.86,49.02 v5.08,47.24 6.03,46.29 R10.1
  Bottom 0.406: IC8.6 6.99,49.15 v6.86,49.02 | U$15.4 4.7,47.62 v5.08,47.24
ONEWIRE1  (via drill 0.5)
  Top 0.406: U$3.4 74.93,3.81 77.47,1.27 96.52,1.27 104.9,9.65 104.9,35.31 v105.16,35.56 | v102.36,35.56 U$5.4 93.22,35.56 v87.38,41.4 | U$14.2 88.27,50.16 v87.38,49.28
  Bottom 0.406: v105.16,35.56 v102.36,35.56 | v87.38,49.28 v87.38,41.4
ONEWIRE2  (via drill 0.5)
  Top 0.406: U$4.4 31.75,3.81 29.21,1.27 8.89,1.27 2.54,7.62 v2.54,35.56 2.54,43.94 v1.52,44.96 | U$6.4 v5.08,35.56
  Bottom 0.406: v2.54,35.56 v5.08,35.56 | U$15.2 1.65,45.09 v1.52,44.96
OUTA1  (via drill 0.5)
  Top 0.406: IC1.1 IC1.OUTA@1 81.93,25.42 v81.92,25.4 | v79.38,22.86 79.38,22.98 IC1.OUTA | IC1.25 76.93,20.23 v76.83,20.32 | IC1.30 81.93,21.61 v81.92,21.59
  Top 5: IC1.OUTA 83.51,23.17 85.09,21.59 85.09,14.73 U$3.A1
  other vias: 81.92,20.32 81.92,22.86 81.92,24.13 80.64,25.4 80.64,24.13 80.64,22.86 80.64,21.59 80.64,20.32 79.38,20.32 79.38,21.59 79.38,24.13 79.38,25.4 78.11,25.4 78.11,24.13 78.11,21.59 78.11,20.32 78.11,22.86 76.83,25.4 76.83,24.13 76.83,22.86 76.83,21.59
  pour Bottom (isolate 0.406): 76.2,26.04 90.42,25.78 90.42,18.8 76.2,19.05
  pour Top (isolate 0.406): 82.04,46.99 82.04,0.25 105.41,0.25 105.41,46.99
OUTA2  (via drill 0.5)
  Top 0.406: IC2.1 IC2.OUTA@1 38.75,25.42 v38.73,25.4 | IC2.25 33.75,20.23 v33.66,20.32 | IC2.OUTA 36,23.05 v36.2,22.86
  Top 5: IC2.OUTA 40.33,23.17 41.91,21.59 41.91,14.73 U$4.A1
  other vias: 33.66,25.4 38.73,24.13 38.73,22.86 38.73,21.59 37.47,25.4 37.47,24.13 37.47,22.86 37.47,21.59 37.47,20.32 36.2,25.4 36.2,24.13 36.2,21.59 36.2,20.32 34.92,25.4 34.92,24.13 34.92,22.86 34.92,21.59 34.92,20.32 33.66,24.13 33.66,22.86 33.66,21.59 38.73,20.32
  pour Bottom (isolate 0.406): 33.02,26.04 52.07,26.04 52.07,19.05 33.02,19.05
  pour Top (isolate 0.406): 38.61,46.99 38.61,0 52.07,0 52.07,46.99
OUTB1  (via drill 0.5)
  Top 0.406: IC1.15 IC1.OUTB@1 67.93,25.42 v67.94,25.4 | v70.48,22.86 70.48,22.98 IC1.OUTB | IC1.21 72.93,20.23 v73.03,20.32
  Top 5: IC1.OUTB 66.35,23.17 64.77,21.59 64.77,14.73 U$3.A2
  other vias: 67.94,24.13 67.94,22.86 67.94,21.59 67.94,20.32 69.22,20.32 69.22,21.59 69.22,22.86 69.22,24.13 69.22,25.4 70.48,20.32 70.48,21.59 70.48,24.13 70.48,25.4 71.75,25.4 71.75,24.13 71.75,22.86 71.75,21.59 71.75,20.32 73.03,22.86 73.03,24.13 73.03,25.4 73.03,21.59
  pour Bottom (isolate 0.406): 53.34,26.04 73.66,26.04 73.66,19.05 53.34,19.05
  pour Top (isolate 0.406): 53.34,46.99 68.07,46.99 68.07,0 53.34,0
OUTB2  (via drill 0.5)
  Top 0.406: IC2.15 IC2.OUTB@1 | IC2.OUTB@1 24.75,26.05 25.4,25.4 | IC2.OUTB@1 24.75,25.42 v24.77,25.4 | IC2.21 29.75,20.23 v29.84,20.32 | v27.3,22.86 27.3,22.98 IC2.OUTB
  Top 5: IC2.OUTB 23.17,23.17 21.59,21.59 21.59,14.73 U$4.A2
  other vias: 24.77,20.32 29.84,25.4 29.84,24.13 29.84,22.86 29.84,21.59 28.57,25.4 28.57,24.13 28.57,22.86 28.57,21.59 28.57,20.32 27.3,25.4 27.3,24.13 27.3,21.59 27.3,20.32 26.04,25.4 26.04,24.13 26.04,22.86 24.77,24.13 24.77,22.86 24.77,21.59 26.04,21.59 26.04,20.32
  pour Bottom (isolate 0.406): 30.48,26.04 15.24,26.04 15.24,19.05 30.48,19.05
  pour Top (isolate 0.406): 3.81,46.99 15.24,46.99 15.24,36.83 24.89,36.83 24.89,0 3.81,0
PWM1
  Top 0.406: PCB1.40 58.74,66.04 62.87,66.04 63.75,65.15 72.01,65.15 72.39,64.77 72.39,60.96 75.56,57.78 IC3.5
PWM1EXT
  Top 0.406: IC1.8 74.93,37.46 75.56,38.1 IC3.12
PWM2  (via drill 0.5)
  Top 0.406: IC6.5 32.38,57.15 v30.48,59.05
  Bottom 0.356: 29.97,59.56 29.97,62.65
  Bottom 0.406: v30.48,59.05 29.97,59.56 | 29.97,62.65 PCB1.18
PWM2EXT
  Top 0.406: IC6.12 32.38,38.1 31.75,37.46 IC2.8
RTSOUT  (via drill 0.5)
  Top 0.406: X1.7 88.27,81.28 86.23,79.25 86.23,75.44 v85.22,74.42 | v78.87,65.41 IC5.7
  Bottom 0.406: v85.22,74.42 85.22,65.41 v78.87,65.41
RX  (via drill 0.5)
  Top 0.406: IC5.12 94.61,67.95 95.25,68.58 95.25,81.28 87.63,88.9 16.51,88.9 11.43,83.82 v11.43,73.66
  Bottom 0.406: PCB1.10 18.53,64.02 11.43,71.12 v11.43,73.66
RXIN
  Top 0.406: IC5.13 93.34,69.22 93.98,69.85 93.98,75.13 X1.2
SCL  (via drill 0.5)
  Top 0.356: 14.73,68.71 14.73,62.67
  Top 0.406: U$11.A3 U$11.B3 19.68,73.66 14.73,68.71 | 14.73,62.67 PCB1.5 10.23,58.17 v7.87,58.17 | v89.66,62.23 89.66,60.96 88.65,59.94 82.8,59.94 v82.55,59.69
  Bottom 0.406: v7.87,58.17 6.99,57.28 IC8.3 6.99,54.48 7.37,54.1 8.64,54.1 10.16,55.63 14.99,55.63 15.49,55.12 15.49,50.55 17.27,48.77 80.77,48.77 81.53,49.53 81.53,58.67 v82.55,59.69 | IC4.3 89.53,62.1 v89.66,62.23
SCLK
  Top 0.356: 35.05,65.91 35.05,62.65
  Top 0.406: U$12.A3 U$12.B3 53.34,72.39 51.56,70.61 37.08,70.61 35.05,68.58 35.05,65.91 | 35.05,62.65 PCB1.23
SDA  (via drill 0.5)
  Top 0.356: 12.19,62.86 12.19,68.07
  Top 0.406: U$11.A5 U$11.B5 | 12.19,68.07 v16.51,72.39 | 12.19,62.86 12.19,62.67 PCB1.3 8.7,59.18 7.37,59.18 v5.84,57.66 7.62,55.88 v16.26,55.88 | v88.14,61.72 87.12,60.71 v81.28,60.71
  Bottom 0.406: v16.26,55.88 16.26,50.8 17.53,49.53 80.01,49.53 80.77,50.29 80.77,60.2 v81.28,60.71 | IC8.2 5.71,57.53 v5.84,57.66 | IC4.2 88.27,61.59 v88.14,61.72 | v16.51,72.39 23.23,72.39 U$11.B5
TX  (via drill 0.5)
  Top 0.406: IC5.11 94.61,66.67 96.52,68.58 96.52,81.28 87.63,90.17 16.51,90.17 10.16,83.82 v10.16,72.39
  Bottom 0.406: PCB1.8 15.99,65.29 10.16,71.12 v10.16,72.39
TXOUT
  Top 0.406: X1.3 92.71,73.66 92.71,71.12 92.08,70.48 IC5.14
VCCEXT1  (via drill 0.5)
  Top 0.406: v74.93,27.94 IC1.VCC@1 IC1.23 | IC1.3 79.93,33.1 v80.01,33.02 | IC1.13 69.93,33.1 v69.85,33.02 | IC1.VCC v74.93,30.48
  Bottom 5: U$5.A1 85.6,28.7 83.82,30.48 v80.01,30.48 v78.74,30.48 v77.47,30.48 v76.2,30.48 v74.93,30.48 v73.66,30.48 v72.39,30.48 v71.12,30.48
  other vias: 71.12,33.02 72.39,33.02 73.66,33.02 74.93,33.02 76.2,33.02 77.47,33.02 78.74,33.02 69.85,31.75 71.12,31.75 72.39,31.75 73.66,31.75 74.93,31.75 76.2,31.75 77.47,31.75 78.74,31.75 80.01,31.75 69.85,30.48 69.85,29.21 71.12,29.21 72.39,29.21 73.66,29.21 76.2,29.21 77.47,29.21 78.74,29.21 80.01,29.21 74.93,29.21 69.85,27.94 71.12,27.94 72.39,27.94 73.66,27.94 76.2,27.94 77.47,27.94 78.74,27.94 80.01,27.94
  pour Bottom (isolate 0.406): 53.34,46.99 58.42,46.99 58.42,34.29 90.42,34.29 90.42,27.3 53.34,27.3
VCCEXT2  (via drill 0.5)
  Top 0.406: IC2.13 26.75,33.1 v26.67,33.02 | IC2.3 36.75,33.1 v36.83,33.02 | v31.75,27.94 IC2.VCC@1 IC2.23 | IC2.VCC v31.75,30.48
  Bottom 5: U$6.A1 13.46,42.42 25.4,30.48 v26.67,30.48 v27.94,30.48 v29.21,30.48 v30.48,30.48 v31.75,30.48 v33.02,30.48 v34.29,30.48 v35.56,30.48
  other vias: 36.83,27.94 36.83,30.48 35.56,27.94 34.29,27.94 33.02,27.94 30.48,27.94 36.83,29.21 36.83,31.75 35.56,33.02 35.56,31.75 35.56,29.21 34.29,29.21 34.29,31.75 34.29,33.02 33.02,33.02 33.02,31.75 33.02,29.21 31.75,33.02 31.75,31.75 31.75,29.21 30.48,29.21 30.48,31.75 30.48,33.02 29.21,33.02 29.21,31.75 29.21,29.21 29.21,27.94 27.94,27.94 27.94,29.21 27.94,31.75 27.94,33.02 26.67,27.94 26.67,29.21 26.67,31.75
  pour Bottom (isolate 0.66): 15.24,34.29 39.37,34.29 39.37,46.99 52.07,46.99 52.07,27.3 15.24,27.3
VCCINT  (via drill 0.5)
  Top 0.356: 27.43,65.53 27.43,62.74 | v88.9,73.66 88.9,73.03 | 70.04,61.28 IC7.4 69.53,61.28
  Top 0.406: 26.04,49.53 U$2.1 26.04,52.7 26.98,53.65 C4.1 28.69,56.31 PCB1.17 28.69,61.48 27.43,62.74 | 26.04,49.53 37.47,49.53 | 37.47,49.53 61.59,49.53 | 61.59,49.53 69.22,49.53 | 69.22,49.53 80.01,49.53 80.64,50.16 IC3.1 80.64,53.02 81.59,53.97 | 69.22,49.53 U$1.1 69.22,53.02 70.17,53.97 C2.1 71.12,55.56 v71.12,55.88 | 37.47,49.53 IC6.1 37.47,52.7 38.41,53.65 C3.1 | 18.41,49.53 26.04,49.53 | U$11.B6 U$11.A6 15.57,85.43 16.51,86.36 22.86,86.36 23.8,85.43 U$11.A9 U$11.B9 23.8,72.73 24.13,72.39 26.67,72.39 28.25,70.81 R8.2 R9.2 28.25,66.36 27.43,65.53 | U$12.B9 U$12.A9 59.69,83.82 68.58,74.93 | IC5.16 88.9,73.03 84.45,73.03 82.55,74.93 68.58,74.93 | C1.1 81.59,53.97 | U$1.7 61.59,49.53 | U$2.7 18.41,49.53 | 70.04,61.28 v70.48,60.83 | 69.53,61.28 68.58,62.23 v68.58,64.01 | 18.41,49.53 16.51,49.53 15.49,50.55 15.49,54.36 14.73,55.12 4.57,55.12 v3.81,55.88 3.81,58.42 6.78,61.39 PCB1.1 | v85.09,58.93 85.09,57.47 81.59,53.97 | 68.58,74.93 v68.58,68.58
  Bottom 0.356: C14.1 v88.9,73.66
  Bottom 0.406: 68.58,66.67 R7.1 67.25,66.42 | 68.58,66.67 R5.2 69.53,64.96 v68.58,64.01 | R6.2 C9.1 | C9.1 70.81,60.51 v70.48,60.83 | C9.1 70.81,56.2 v71.12,55.88 | IC4.1 85.35,59.75 C15.1 v85.09,58.93 | C17.1 3.81,56.2 | 3.81,56.2 4.18,56.2 IC8.1 | v3.81,55.88 3.81,56.2 | v68.58,68.58 68.58,66.67

### Text on the board
Measures: serial | stacked serial | stacked serial | modular connector | modular connector | modular connector | modular connector